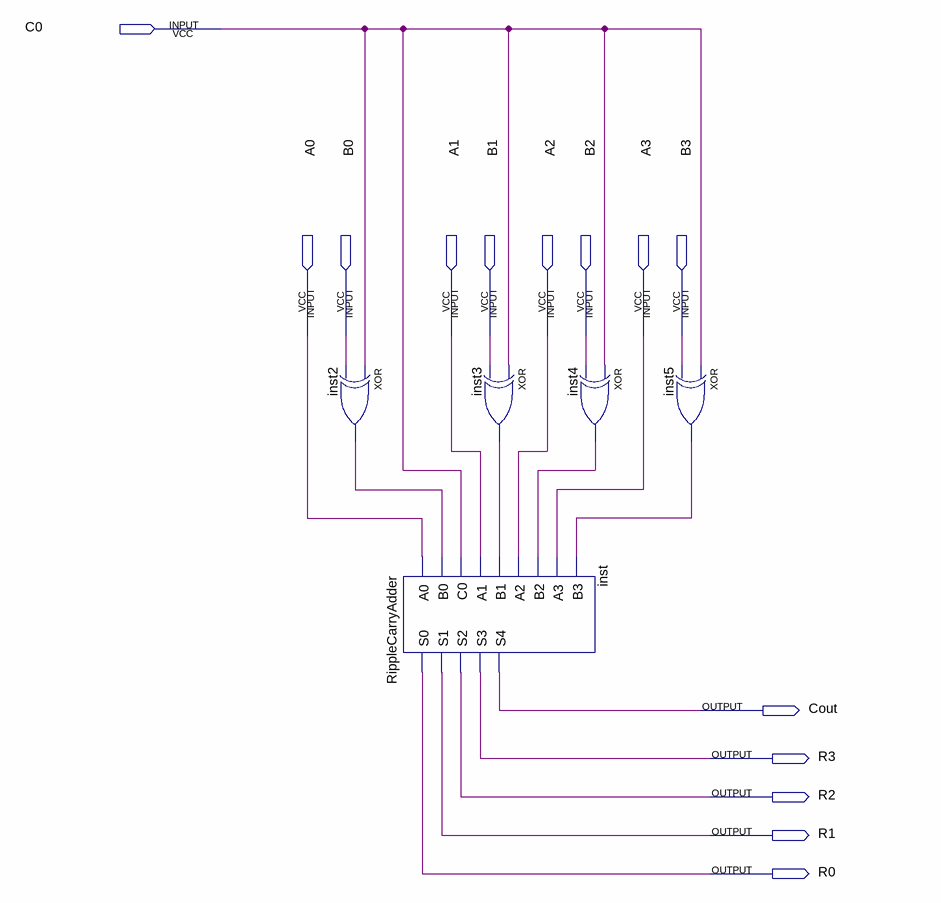
[diagram p0: schematic sheet]
// Quartus schematic Adder_Subtractor.bdf as structural Verilog: 5 symbols, 14 pins
module Adder_Subtractor (
  input  C0,
  input  A0,
  input  B0,
  input  A1,
  input  B1,
  input  A2,
  input  B2,
  input  A3,
  input  B3,
  output Cout,
  output R3,
  output R2,
  output R1,
  output R0
);

  wire inst2_out, inst3_out, inst4_out, inst5_out;

  xor inst2 (inst2_out, C0, B0);
  RippleCarryAdder inst (
    .A0(A0), .B0(inst2_out), .C0(C0), .A1(A1), .B1(inst3_out), .A2(A2), .B2(inst4_out), .A3(A3),
    .B3(inst5_out), .S0(R0), .S1(R1), .S2(R2), .S3(R3), .S4(Cout));
  xor inst3 (inst3_out, C0, B1);
  xor inst4 (inst4_out, C0, B2);
  xor inst5 (inst5_out, C0, B3);
endmodule
